# EAGLE schematic iv17-display-shield (EAGLE 7.3.0)
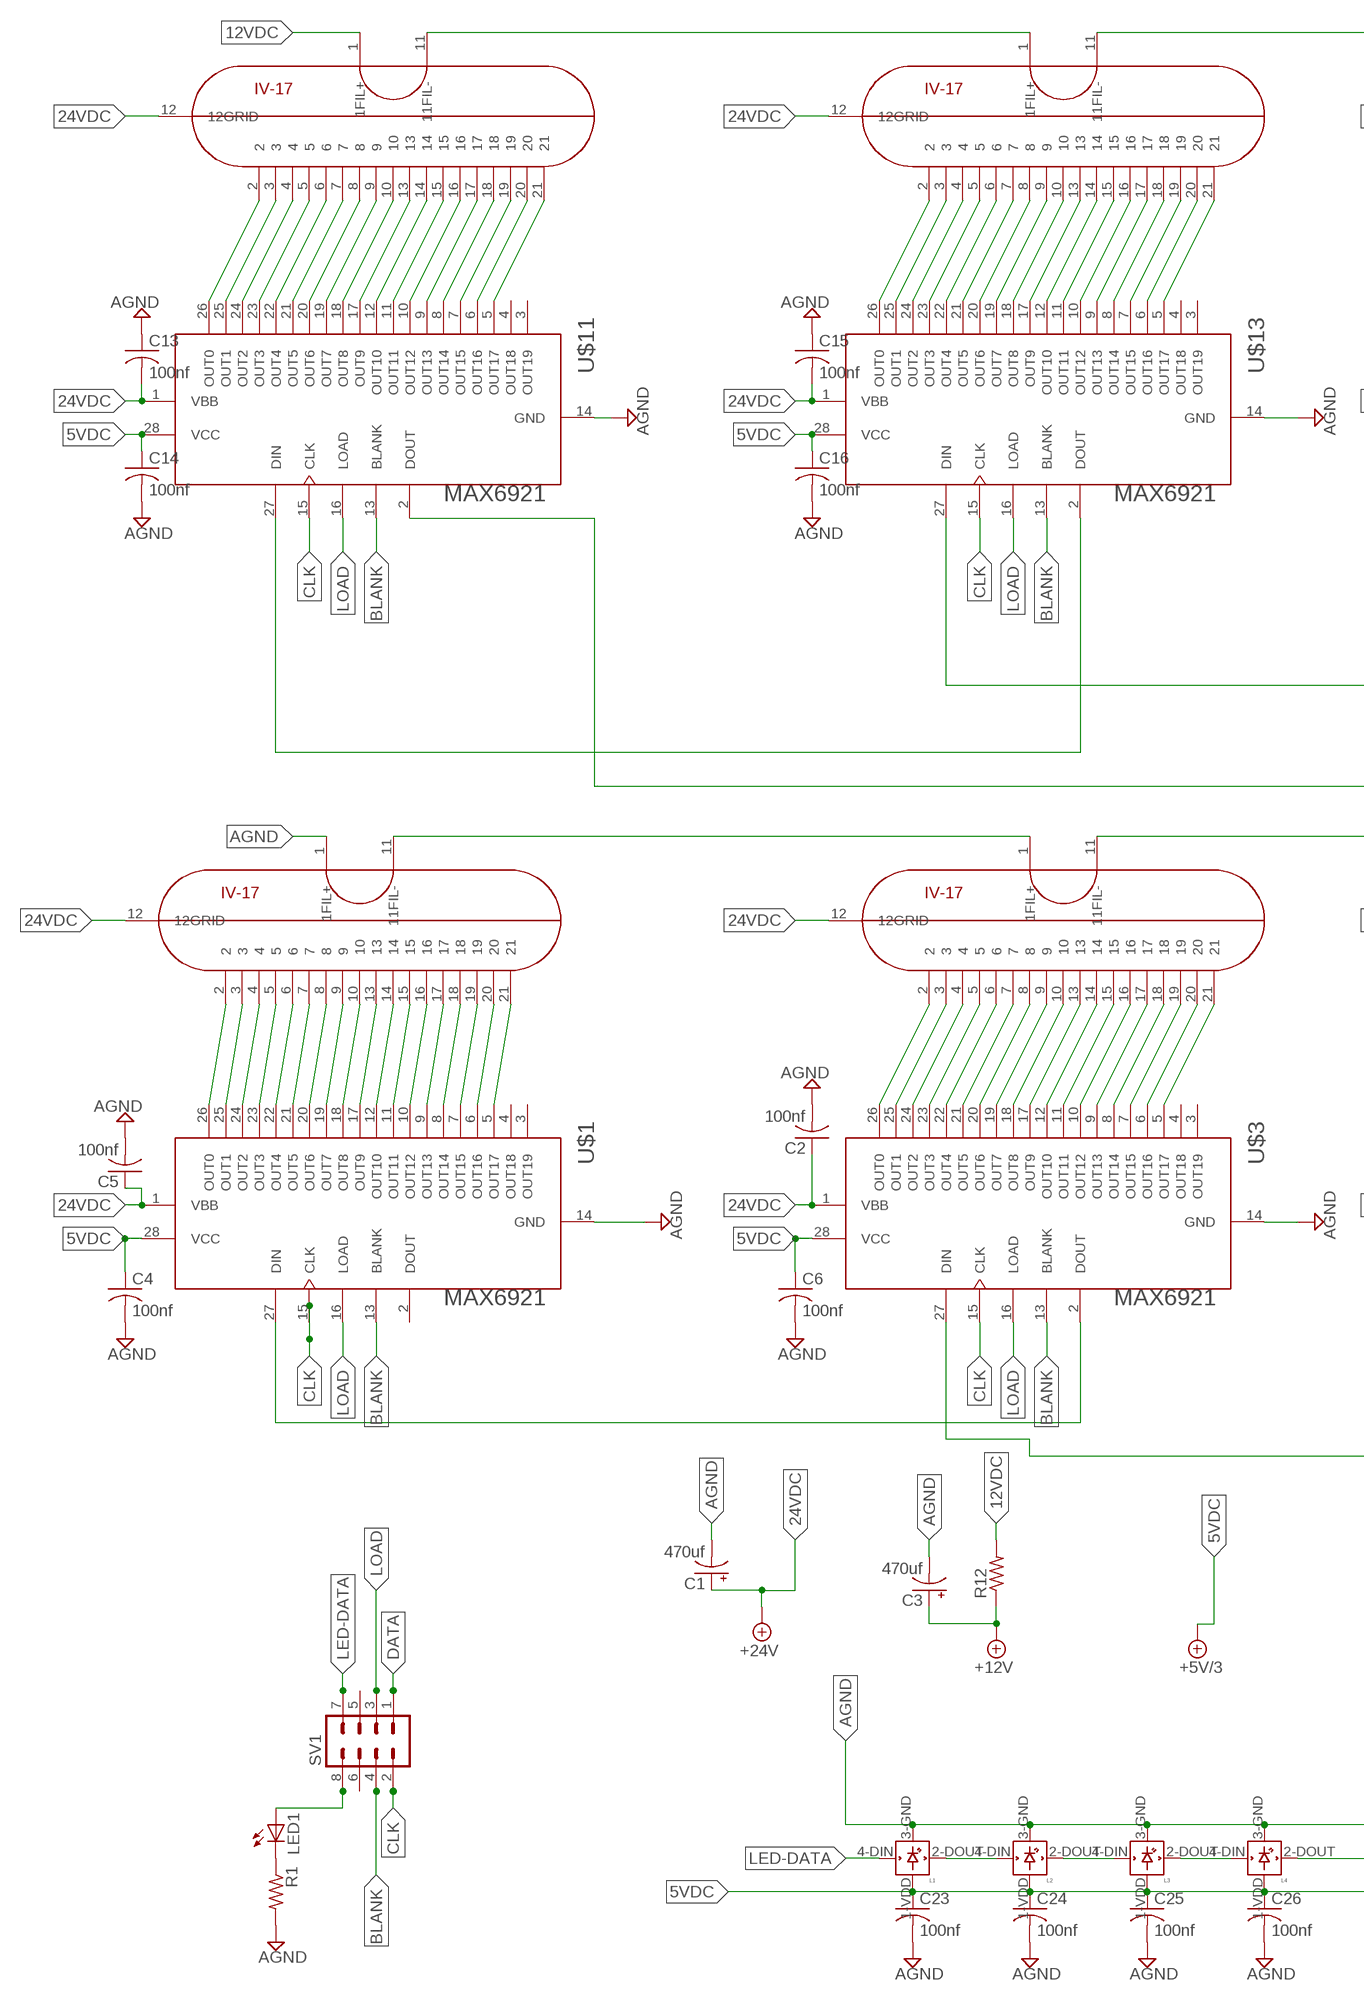
[diagram p0: schematic, sheet 1, part 1 of 2]
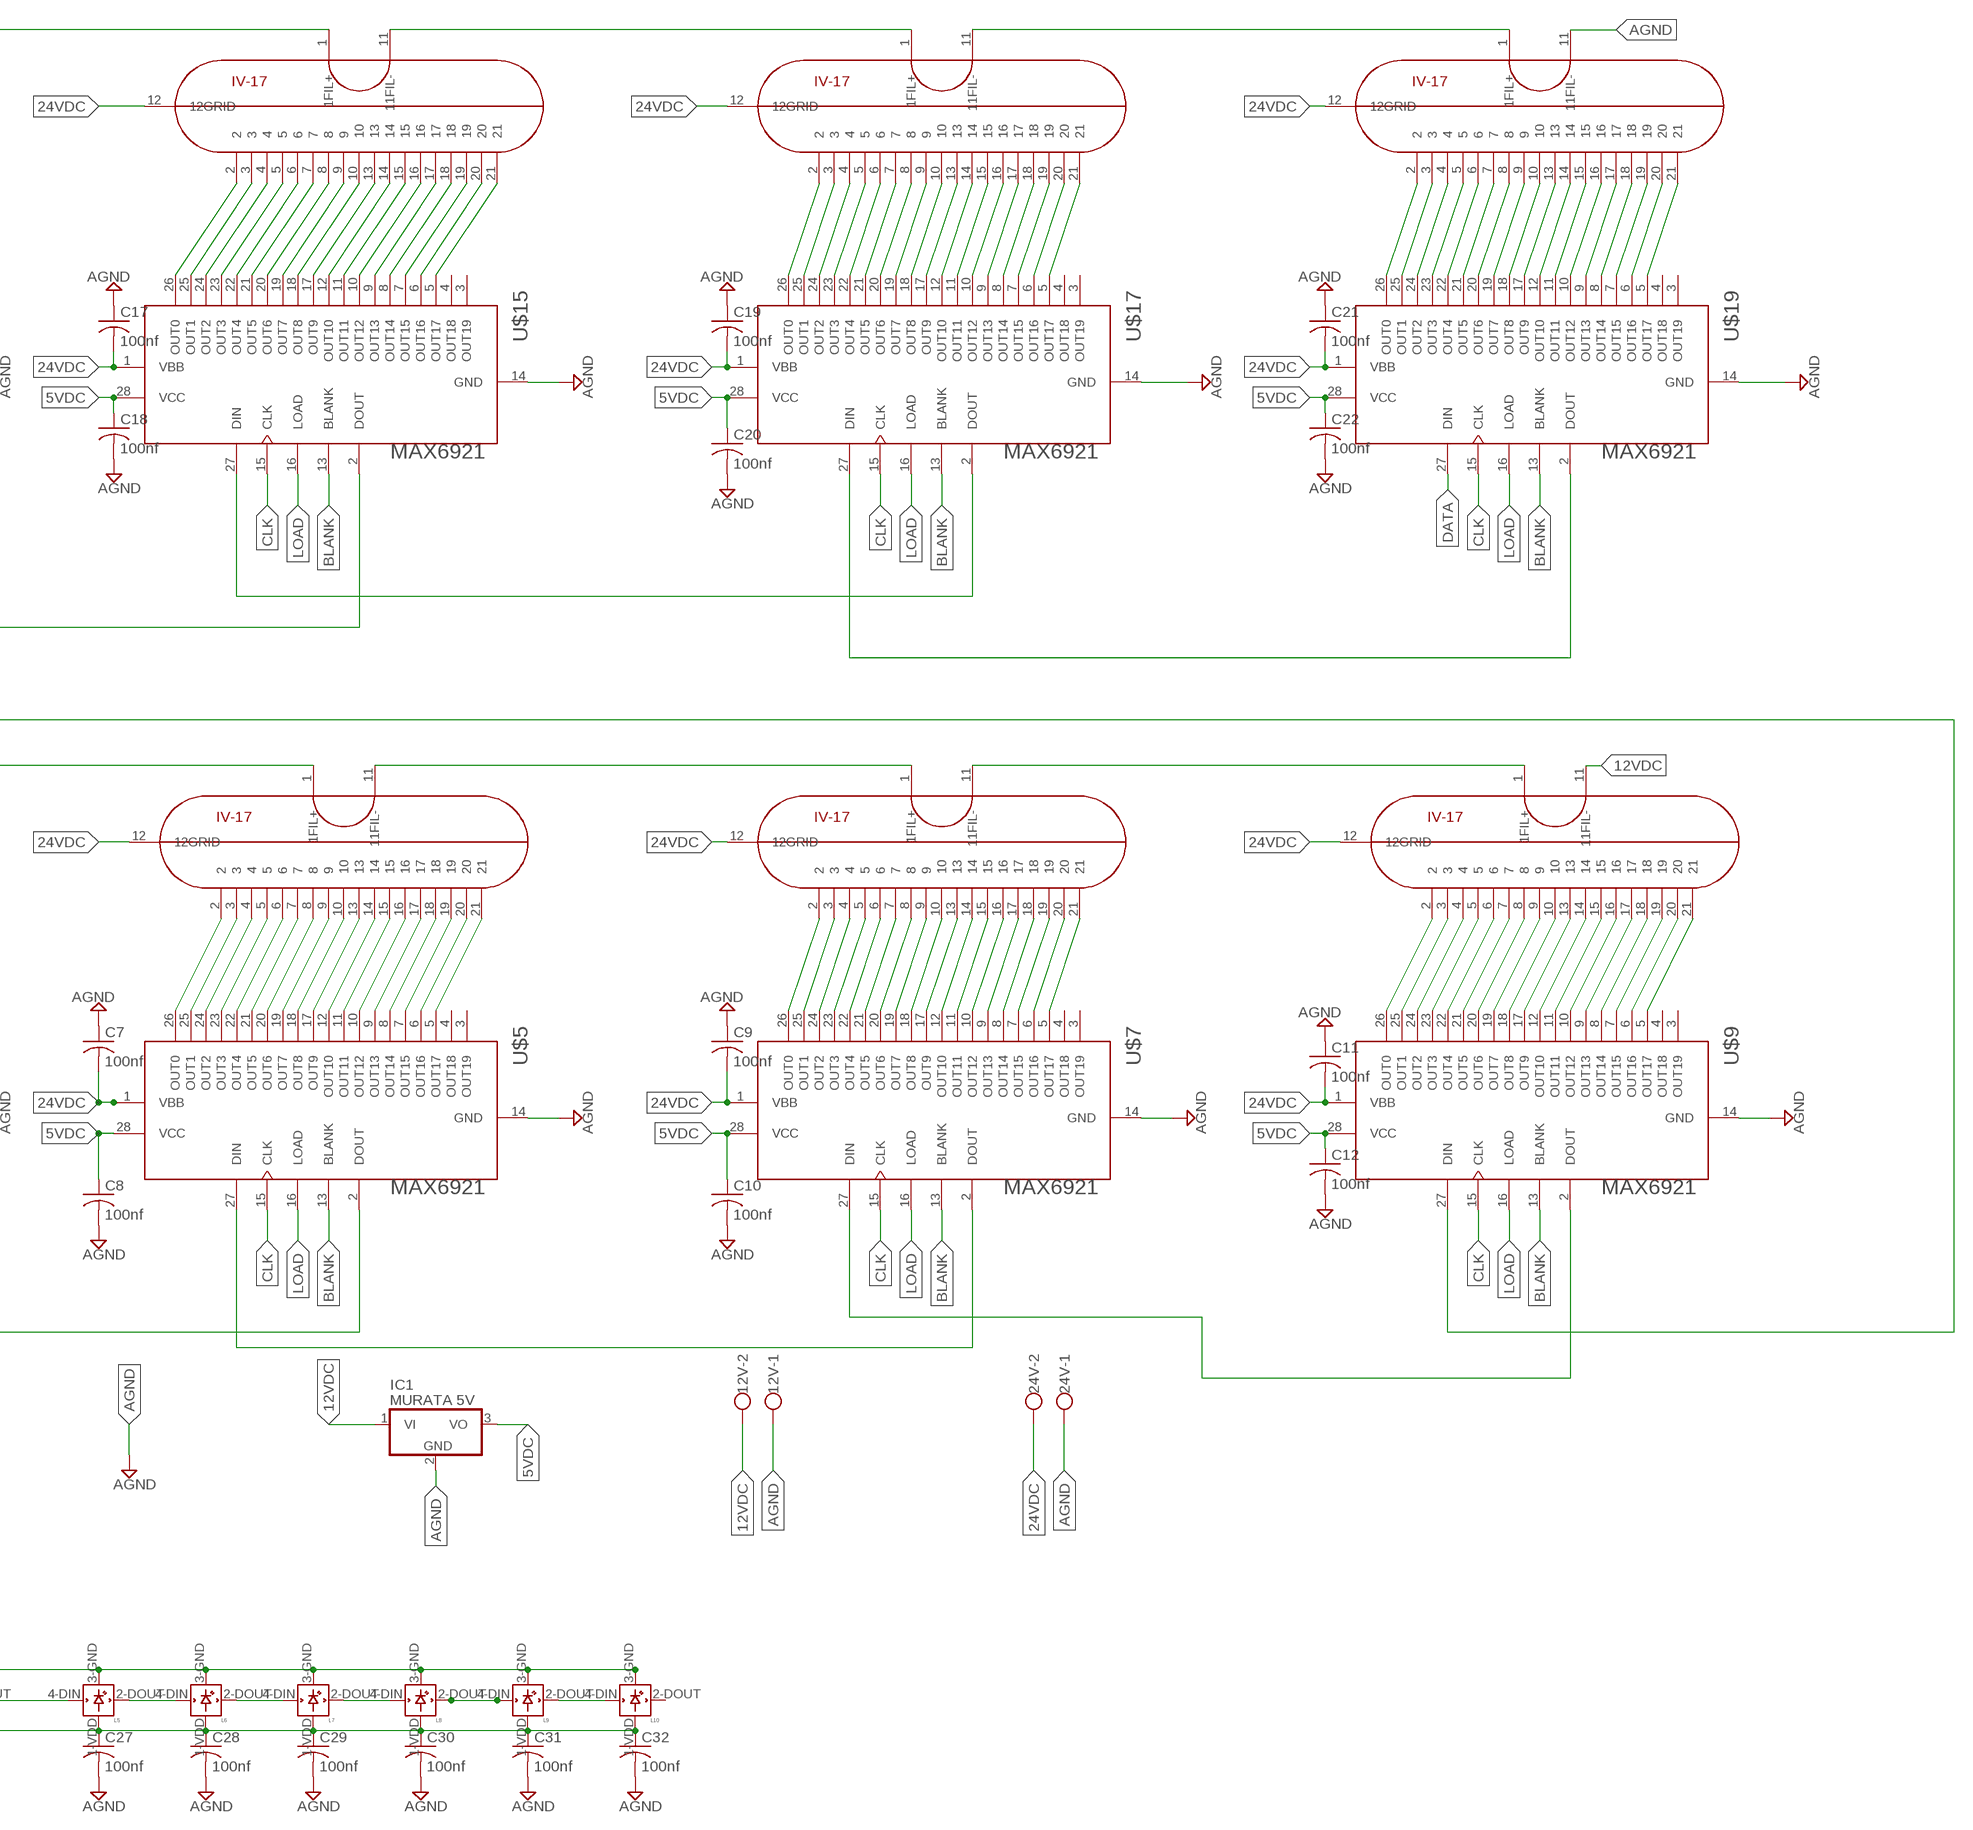
[diagram p1: schematic, sheet 1, part 2 of 2]

## Parts
12V  W237-102  [W237-102]
24V  W237-102  [W237-102]
C1  470uf  CPOL-USE5-10.5  [E5-10,5]
C2  100nf  C-USC1206  [C1206]
C3  470uf  CPOL-USE5-10.5  [E5-10,5]
C4  100nf  C-USC1206  [C1206]
C5  100nf  C-USC1206  [C1206]
C6  100nf  C-USC1206  [C1206]
C7  100nf  C-USC1206  [C1206]
C8  100nf  C-USC1206  [C1206]
C9  100nf  C-USC1206  [C1206]
C10  100nf  C-USC1206  [C1206]
C11  100nf  C-USC1206  [C1206]
C12  100nf  C-USC1206  [C1206]
C13  100nf  C-USC1206  [C1206]
C14  100nf  C-USC1206  [C1206]
C15  100nf  C-USC1206  [C1206]
C16  100nf  C-USC1206  [C1206]
C17  100nf  C-USC1206  [C1206]
C18  100nf  C-USC1206  [C1206]
C19  100nf  C-USC1206  [C1206]
C20  100nf  C-USC1206  [C1206]
C21  100nf  C-USC1206  [C1206]
C22  100nf  C-USC1206  [C1206]
C23  100nf  C-USC1206  [C1206]
C24  100nf  C-USC1206  [C1206]
C25  100nf  C-USC1206  [C1206]
C26  100nf  C-USC1206  [C1206]
C27  100nf  C-USC1206  [C1206]
C28  100nf  C-USC1206  [C1206]
C29  100nf  C-USC1206  [C1206]
C30  100nf  C-USC1206  [C1206]
C31  100nf  C-USC1206  [C1206]
C32  100nf  C-USC1206  [C1206]
IC1  MURATA 5V  786TV  [TO220V]
L1  WS2812B  [WS2812B]
L2  WS2812B  [WS2812B]
L3  WS2812B  [WS2812B]
L4  WS2812B  [WS2812B]
L5  WS2812B  [WS2812B]
L6  WS2812B  [WS2812B]
L7  WS2812B  [WS2812B]
L8  WS2812B  [WS2812B]
L9  WS2812B  [WS2812B]
L10  WS2812B  [WS2812B]
LED1  LEDSMT1206  [1206]
R1  R-US_R1206  [R1206]
R12  R-US_0207/10  [0207/10]
SV1  MA04-2  [MA04-2]
U$1  MAX6921  [SOIC-28W]
U$2  IV17  [NIXIE-22]
U$3  MAX6921  [SOIC-28W]
U$4  IV17  [NIXIE-22]
U$5  MAX6921  [SOIC-28W]
U$6  IV17  [NIXIE-22]
U$7  MAX6921  [SOIC-28W]
U$8  IV17  [NIXIE-22]
U$9  MAX6921  [SOIC-28W]
U$10  IV17  [NIXIE-22]
U$11  MAX6921  [SOIC-28W]
U$12  IV17  [NIXIE-22]
U$13  MAX6921  [SOIC-28W]
U$14  IV17  [NIXIE-22]
U$15  MAX6921  [SOIC-28W]
U$16  IV17  [NIXIE-22]
U$17  MAX6921  [SOIC-28W]
U$18  IV17  [NIXIE-22]
U$19  MAX6921  [SOIC-28W]
U$20  IV17  [NIXIE-22]

## Nets
5VDC: C4.1 C6.1 C8.1 C10.1 C12.1 C14.1 C16.1 C18.1 C20.1 C22.1 C23.1 C24.1 C25.1 C26.1 C27.1 C28.1 C29.1 C30.1 C31.1 C32.1 IC1.3(VO) L1.1-VDD(VDD) L2.1-VDD(VDD) L3.1-VDD(VDD) L4.1-VDD(VDD) L5.1-VDD(VDD) L6.1-VDD(VDD) L7.1-VDD(VDD) L8.1-VDD(VDD) L9.1-VDD(VDD) L10.1-VDD(VDD) U$1.28(VCC) U$3.28(VCC) U$5.28(VCC) U$7.28(VCC) U$9.28(VCC) U$11.28(VCC) U$13.28(VCC) U$15.28(VCC) U$17.28(VCC) U$19.28(VCC) ; supply symbol labelled +5V/3
12VDC: 12V.2 IC1.1(VI) R12.2 U$10.11(11FIL-) U$12.1(1FIL+)
24VDC: 24V.2 C1.+ C2.1 C5.1 C7.2 C9.2 C11.2 C13.2 C15.2 C17.2 C19.2 C21.2 U$1.1(VBB) U$2.12(12GRID) U$3.1(VBB) U$4.12(12GRID) U$5.1(VBB) U$6.12(12GRID) U$7.1(VBB) U$8.12(12GRID) U$9.1(VBB) U$10.12(12GRID) U$11.1(VBB) U$12.12(12GRID) U$13.1(VBB) U$14.12(12GRID) U$15.1(VBB) U$16.12(12GRID) U$17.1(VBB) U$18.12(12GRID) U$19.1(VBB) U$20.12(12GRID) ; supply symbol labelled +24V
+12V: C3.+ R12.1
AGND: 12V.1 24V.1 C1.- C2.2 C3.- C4.2 C5.2 C6.2 C7.1 C8.2 C9.1 C10.2 C11.1 C12.2 C13.1 C14.2 C15.1 C16.2 C17.1 C18.2 C19.1 C20.2 C21.1 C22.2 C23.2 C24.2 C25.2 C26.2 C27.2 C28.2 C29.2 C30.2 C31.2 C32.2 IC1.2(GND) L1.3-GND(GND) L2.3-GND(GND) L3.3-GND(GND) L4.3-GND(GND) L5.3-GND(GND) L6.3-GND(GND) L7.3-GND(GND) L8.3-GND(GND) L9.3-GND(GND) L10.3-GND(GND) R1.2 U$1.14(GND) U$2.1(1FIL+) U$3.14(GND) U$5.14(GND) U$7.14(GND) U$9.14(GND) U$11.14(GND) U$13.14(GND) U$15.14(GND) U$17.14(GND) U$19.14(GND) U$20.11(11FIL-)
BLANK: SV1.4 U$1.13(BLANK) U$3.13(BLANK) U$5.13(BLANK) U$7.13(BLANK) U$9.13(BLANK) U$11.13(BLANK) U$13.13(BLANK) U$15.13(BLANK) U$17.13(BLANK) U$19.13(BLANK)
CLK: SV1.2 U$1.15(CLK) U$3.15(CLK) U$5.15(CLK) U$7.15(CLK) U$9.15(CLK) U$11.15(CLK) U$13.15(CLK) U$15.15(CLK) U$17.15(CLK) U$19.15(CLK)
DATA: SV1.1 U$19.27(DIN)
LED-DATA: L1.4-DIN(DIN) SV1.7
LOAD: SV1.3 U$1.16(LOAD) U$3.16(LOAD) U$5.16(LOAD) U$7.16(LOAD) U$9.16(LOAD) U$11.16(LOAD) U$13.16(LOAD) U$15.16(LOAD) U$17.16(LOAD) U$19.16(LOAD)
N$1: U$1.26(OUT0) U$2.2
N$2: U$1.25(OUT1) U$2.3
N$3: U$1.24(OUT2) U$2.4
N$4: U$1.23(OUT3) U$2.5
N$5: U$1.22(OUT4) U$2.6
N$6: U$1.21(OUT5) U$2.7
N$7: U$1.20(OUT6) U$2.8
N$8: U$1.19(OUT7) U$2.9
N$9: U$1.18(OUT8) U$2.10
N$10: U$1.17(OUT9) U$2.13
N$11: U$1.12(OUT10) U$2.14
N$12: U$1.11(OUT11) U$2.15
N$13: U$1.10(OUT12) U$2.16
N$14: U$1.9(OUT13) U$2.17
N$15: U$1.8(OUT14) U$2.18
N$16: U$1.7(OUT15) U$2.19
N$17: U$1.6(OUT16) U$2.20
N$18: U$1.5(OUT17) U$2.21
N$19: U$3.26(OUT0) U$4.2
N$20: U$3.25(OUT1) U$4.3
N$21: U$3.24(OUT2) U$4.4
N$22: U$3.23(OUT3) U$4.5
N$23: U$17.27(DIN) U$19.2(DOUT)
N$24: U$3.22(OUT4) U$4.6
N$25: U$3.21(OUT5) U$4.7
N$26: U$3.20(OUT6) U$4.8
N$27: U$3.19(OUT7) U$4.9
N$28: U$3.18(OUT8) U$4.10
N$29: U$3.17(OUT9) U$4.13
N$30: U$3.12(OUT10) U$4.14
N$31: U$3.11(OUT11) U$4.15
N$32: U$3.10(OUT12) U$4.16
N$33: U$3.9(OUT13) U$4.17
N$34: U$3.8(OUT14) U$4.18
N$35: U$3.7(OUT15) U$4.19
N$36: U$3.6(OUT16) U$4.20
N$37: U$3.5(OUT17) U$4.21
N$38: U$5.26(OUT0) U$6.2
N$39: U$5.25(OUT1) U$6.3
N$40: U$5.24(OUT2) U$6.4
N$41: U$15.27(DIN) U$17.2(DOUT)
N$42: U$5.23(OUT3) U$6.5
N$43: U$5.22(OUT4) U$6.6
N$44: U$5.21(OUT5) U$6.7
N$45: U$5.20(OUT6) U$6.8
N$46: U$5.19(OUT7) U$6.9
N$47: U$5.18(OUT8) U$6.10
N$48: U$5.17(OUT9) U$6.13
N$49: U$5.12(OUT10) U$6.14
N$50: U$5.11(OUT11) U$6.15
N$51: U$5.10(OUT12) U$6.16
N$52: U$5.9(OUT13) U$6.17
N$53: U$5.8(OUT14) U$6.18
N$54: U$5.7(OUT15) U$6.19
N$55: U$5.6(OUT16) U$6.20
N$56: U$5.5(OUT17) U$6.21
N$57: U$7.26(OUT0) U$8.2
N$58: U$7.25(OUT1) U$8.3
N$59: U$7.24(OUT2) U$8.4
N$60: U$7.23(OUT3) U$8.5
N$61: U$7.22(OUT4) U$8.6
N$62: U$7.21(OUT5) U$8.7
N$63: U$11.27(DIN) U$13.2(DOUT)
N$64: U$7.20(OUT6) U$8.8
N$65: U$7.19(OUT7) U$8.9
N$66: U$7.18(OUT8) U$8.10
N$67: U$7.17(OUT9) U$8.13
N$68: U$7.12(OUT10) U$8.14
N$69: U$7.11(OUT11) U$8.15
N$70: U$7.10(OUT12) U$8.16
N$71: U$7.9(OUT13) U$8.17
N$72: U$7.8(OUT14) U$8.18
N$73: U$7.7(OUT15) U$8.19
N$74: U$7.6(OUT16) U$8.20
N$75: U$7.5(OUT17) U$8.21
N$76: U$9.26(OUT0) U$10.2
N$77: U$9.25(OUT1) U$10.3
N$78: U$9.24(OUT2) U$10.4
N$79: U$9.23(OUT3) U$10.5
N$80: U$9.22(OUT4) U$10.6
N$81: U$9.21(OUT5) U$10.7
N$82: U$9.20(OUT6) U$10.8
N$83: U$9.19(OUT7) U$10.9
N$84: U$9.18(OUT8) U$10.10
N$85: U$9.27(DIN) U$11.2(DOUT)
N$86: U$9.17(OUT9) U$10.13
N$87: U$9.12(OUT10) U$10.14
N$88: U$9.11(OUT11) U$10.15
N$89: U$9.10(OUT12) U$10.16
N$90: U$9.9(OUT13) U$10.17
N$91: U$9.8(OUT14) U$10.18
N$92: U$9.7(OUT15) U$10.19
N$93: U$9.6(OUT16) U$10.20
N$94: U$9.5(OUT17) U$10.21
N$95: U$11.26(OUT0) U$12.2
N$96: U$11.25(OUT1) U$12.3
N$97: U$11.24(OUT2) U$12.4
N$98: U$11.23(OUT3) U$12.5
N$99: U$11.22(OUT4) U$12.6
N$100: U$11.21(OUT5) U$12.7
N$101: U$11.20(OUT6) U$12.8
N$102: U$11.19(OUT7) U$12.9
N$103: U$11.18(OUT8) U$12.10
N$104: U$11.17(OUT9) U$12.13
N$105: U$11.12(OUT10) U$12.14
N$106: U$11.11(OUT11) U$12.15
N$107: U$7.27(DIN) U$9.2(DOUT)
N$108: U$11.10(OUT12) U$12.16
N$109: L1.2-DOUT(DOUT) L2.4-DIN(DIN)
N$110: L2.2-DOUT(DOUT) L3.4-DIN(DIN)
N$111: U$8.11(11FIL-) U$10.1(1FIL+)
N$112: U$6.11(11FIL-) U$8.1(1FIL+)
N$113: U$4.11(11FIL-) U$6.1(1FIL+)
N$114: U$2.11(11FIL-) U$4.1(1FIL+)
N$115: U$11.9(OUT13) U$12.17
N$116: U$11.8(OUT14) U$12.18
N$117: U$11.7(OUT15) U$12.19
N$118: U$11.6(OUT16) U$12.20
N$119: U$11.5(OUT17) U$12.21
N$120: U$13.26(OUT0) U$14.2
N$121: U$13.25(OUT1) U$14.3
N$122: U$13.24(OUT2) U$14.4
N$123: U$13.23(OUT3) U$14.5
N$124: U$13.22(OUT4) U$14.6
N$125: U$13.21(OUT5) U$14.7
N$126: U$13.20(OUT6) U$14.8
N$127: U$13.19(OUT7) U$14.9
N$128: U$13.18(OUT8) U$14.10
N$129: U$13.17(OUT9) U$14.13
N$130: U$13.12(OUT10) U$14.14
N$131: U$13.11(OUT11) U$14.15
N$132: U$13.10(OUT12) U$14.16
N$133: U$5.27(DIN) U$7.2(DOUT)
N$134: U$13.9(OUT13) U$14.17
N$135: L3.2-DOUT(DOUT) L4.4-DIN(DIN)
N$136: U$13.8(OUT14) U$14.18
N$137: U$13.7(OUT15) U$14.19
N$138: U$13.6(OUT16) U$14.20
N$139: U$13.5(OUT17) U$14.21
N$140: U$15.26(OUT0) U$16.2
N$141: U$15.25(OUT1) U$16.3
N$142: U$15.24(OUT2) U$16.4
N$143: U$15.23(OUT3) U$16.5
N$144: U$15.22(OUT4) U$16.6
N$145: U$15.21(OUT5) U$16.7
N$146: U$15.20(OUT6) U$16.8
N$147: U$15.19(OUT7) U$16.9
N$148: U$15.18(OUT8) U$16.10
N$149: U$15.17(OUT9) U$16.13
N$150: U$15.12(OUT10) U$16.14
N$151: U$15.11(OUT11) U$16.15
N$152: U$15.10(OUT12) U$16.16
N$153: U$15.9(OUT13) U$16.17
N$154: U$15.8(OUT14) U$16.18
N$155: U$3.27(DIN) U$5.2(DOUT)
N$156: U$15.7(OUT15) U$16.19
N$157: L4.2-DOUT(DOUT) L5.4-DIN(DIN)
N$158: L5.2-DOUT(DOUT) L6.4-DIN(DIN)
N$159: U$15.6(OUT16) U$16.20
N$160: U$15.5(OUT17) U$16.21
N$161: U$17.26(OUT0) U$18.2
N$162: U$17.25(OUT1) U$18.3
N$163: U$17.24(OUT2) U$18.4
N$164: U$17.23(OUT3) U$18.5
N$165: U$17.22(OUT4) U$18.6
N$166: U$17.21(OUT5) U$18.7
N$167: U$17.20(OUT6) U$18.8
N$168: U$17.19(OUT7) U$18.9
N$169: U$17.18(OUT8) U$18.10
N$170: U$17.17(OUT9) U$18.13
N$171: U$17.12(OUT10) U$18.14
N$172: U$17.11(OUT11) U$18.15
N$173: U$17.10(OUT12) U$18.16
N$174: U$17.9(OUT13) U$18.17
N$175: U$17.8(OUT14) U$18.18
N$176: U$17.7(OUT15) U$18.19
N$177: U$13.27(DIN) U$15.2(DOUT)
N$178: U$17.6(OUT16) U$18.20
N$179: L6.2-DOUT(DOUT) L7.4-DIN(DIN)
N$180: L7.2-DOUT(DOUT) L8.4-DIN(DIN)
N$181: U$17.5(OUT17) U$18.21
N$182: U$19.26(OUT0) U$20.2
N$183: U$19.25(OUT1) U$20.3
N$184: U$19.24(OUT2) U$20.4
N$185: U$19.23(OUT3) U$20.5
N$186: U$19.22(OUT4) U$20.6
N$187: U$19.21(OUT5) U$20.7
N$188: U$19.20(OUT6) U$20.8
N$189: U$19.19(OUT7) U$20.9
N$190: U$19.18(OUT8) U$20.10
N$191: U$19.17(OUT9) U$20.13
N$192: U$19.12(OUT10) U$20.14
N$193: U$19.11(OUT11) U$20.15
N$194: U$19.10(OUT12) U$20.16
N$195: U$19.9(OUT13) U$20.17
N$196: U$19.8(OUT14) U$20.18
N$197: U$19.7(OUT15) U$20.19
N$198: U$19.6(OUT16) U$20.20
N$199: U$1.27(DIN) U$3.2(DOUT)
N$200: U$19.5(OUT17) U$20.21
N$201: L8.2-DOUT(DOUT) L9.4-DIN(DIN)
N$202: L9.2-DOUT(DOUT) L10.4-DIN(DIN)
N$204: LED1.C R1.1
N$205: LED1.A SV1.8
N$225: U$18.11(11FIL-) U$20.1(1FIL+)
N$226: U$16.11(11FIL-) U$18.1(1FIL+)
N$227: U$14.11(11FIL-) U$16.1(1FIL+)
N$228: U$12.11(11FIL-) U$14.1(1FIL+)
Unconnected: L10.2-DOUT(DOUT) SV1.5 SV1.6 U$1.2(DOUT) U$1.3(OUT19) U$1.4(OUT18) U$3.3(OUT19) U$3.4(OUT18) U$5.3(OUT19) U$5.4(OUT18) U$7.3(OUT19) U$7.4(OUT18) U$9.3(OUT19) U$9.4(OUT18) U$11.3(OUT19) U$11.4(OUT18) U$13.3(OUT19) U$13.4(OUT18) U$15.3(OUT19) U$15.4(OUT18) U$17.3(OUT19) U$17.4(OUT18) U$19.3(OUT19) U$19.4(OUT18)

## Library data of the parts
12V 24V = con-wago-500:W237-102: WAGO SCREW CLAMP; MPN: 237-102; OC_FARNELL: unknown; OC_NEWARK: 70K9898
C1 C3 = rcl:CPOL-US: POLARIZED CAPACITOR, American symbol
C2 C4-C32 = rcl:C-US: CAPACITOR, American symbol
IC1 = linear:78*: Positive VOLTAGE REGULATOR Source: http://cache.national.com/ds/LM/LM78L05.pdf http://www.fairchildsemi.com/ds/LM/LM7805.pdf
L1-L10 = adafruit:WS2812B
LED1 = adafruit:LED: LED OSRAM: - CHIPLED LG R971, LG N971, LY N971, LG Q971, LY Q971, LO R971, LY R971 LH N974, LH R974 LS Q976, LO Q976, LY Q976 LO Q996 - Hyper CHIPLED LW Q18S LB Q993, LB Q99A, LB R99A - SideLED LS A670, LO A670, LY A670, LG A670, LP A670 LB A673, LV A673, LT A673, LW A673 LH A674 LY A675 LS A676, LA A676, LO A676, LY A676, LW A676 LS A679, LY A679, LG A679 - Hyper Micro SIDELED® LS Y876, LA Y876, LO Y876, LY Y876 LT Y87S - SmartLED LW L88C, LW L88S LB L89C, LB L89S, LG L890 LS L89K, LO L89K, LY L89K LS L896, LA L896, LO L896, LY L896 - TOPLED LS T670, LO T670, LY T670, LG T670, LP T670 LSG T670, LSP T670, LSY T670, LOP T670, LYG T670 LG T671, LOG T671, LSG T671 LB T673, LV T673, LT T673, LW T673 LH T674 LS T676, LA T676, LO T676, LY T676, LB T676, LH T676, LSB T676, LW T676 LB T67C, LV T67C, LT T67C, LS T67K, LO T67K, LY T67K, LW E67C LS E67B, LA E67B, LO E67B, LY E67B, LB E67C, LV E67C, LT E67C LW T67C LS T679, LY T679, LG T679 LS T770, LO T770, LY T770, LG T770, LP T770 LB T773, LV T773, LT T773, LW T773 LH T774 LS E675, LA E675, LY E675, LS T675 LS T776, LA T776, LO T776, LY T776, LB T776 LHGB T686 LT T68C, LB T68C - Hyper Mini TOPLED® LB M676 - Mini TOPLED Santana® LG M470 LS M47K, LO M47K, LY M47K Source: http://www.osram.convergy.de/
R1 R12 = rcl:R-US_: RESISTOR, American symbol
SV1 = con-lstb:MA04-2: PIN HEADER; OC_FARNELL: unknown; OC_NEWARK: unknown
U$1 U$3 U$5 U$7 U$9 U$11 U$13 U$15 U$17 U$19 = adafruit:MAX6921: MAX6921 76V VFD driver in TSSOP and PLCC. Can be cascaded, talk to it via SPI
U$2 U$4 U$6 U$8 U$10 U$12 U$14 U$16 U$18 U$20 = XXXXXXtube supl:IV17